# Altium schematic sheet FPGA_A3P10002.SchDoc
size A2
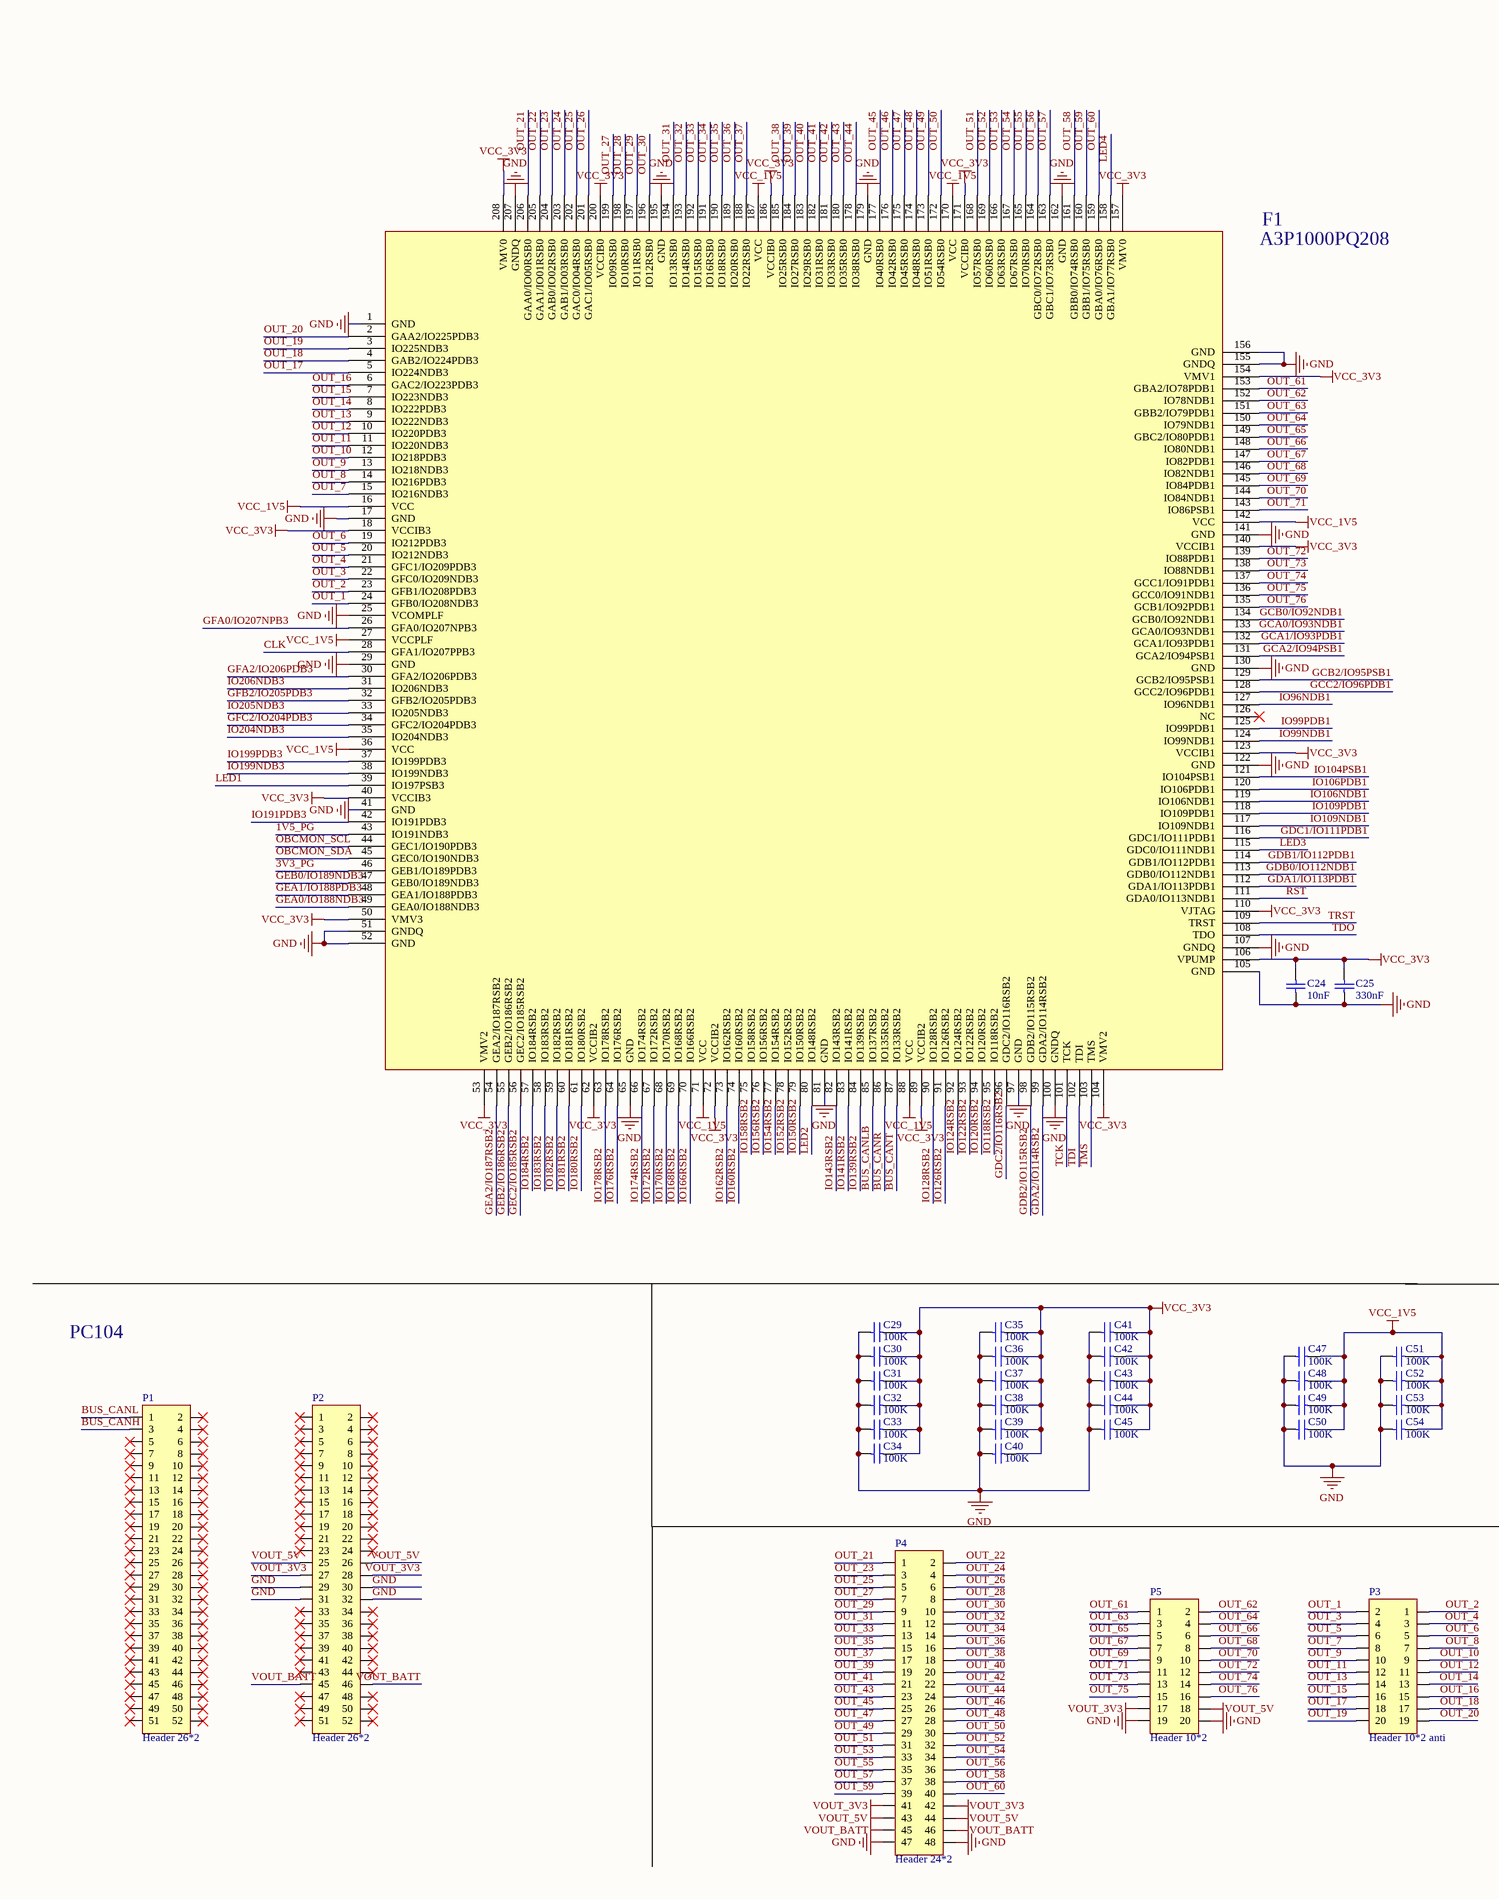
[diagram p0: FPGA_A3P10002.SchDoc, left]
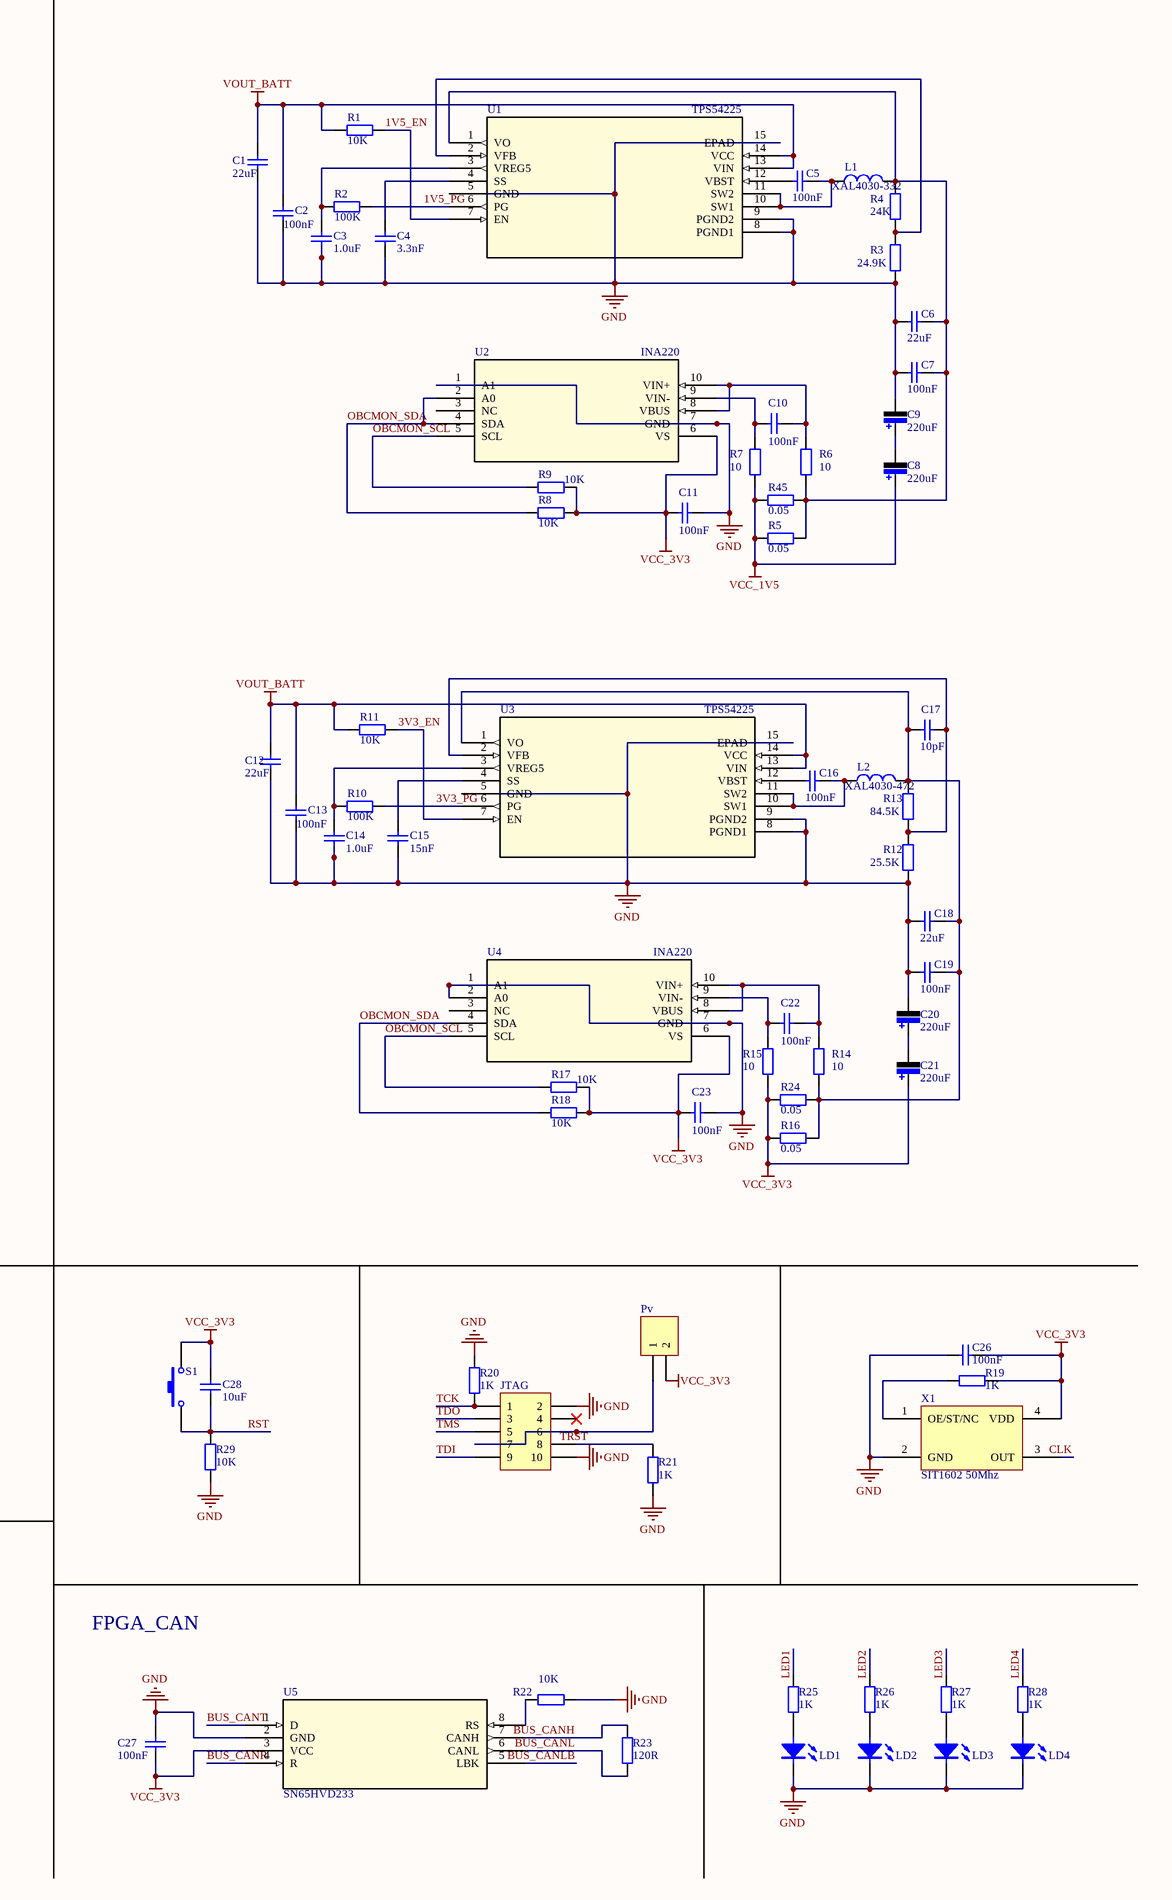
[diagram p1: FPGA_A3P10002.SchDoc, right]

## Parts
C1  value 22uF  [C 1210]  (hidden comment: Cap)
C2  value 100nF  [0603-2]  (hidden comment: Cap)
C3  value 1.0uF  [0603-2]  (hidden comment: Cap)
C4  value 3.3nF  [0603-2]  (hidden comment: Cap)
C5  value 100nF  [0603-2]  (hidden comment: Cap)
C6  value 22uF  [C 1210]  (hidden comment: Cap)
C7  value 100nF  [0603-2]  (hidden comment: Cap)
C8  value 220uF  [CAP-7343]  (hidden comment: Cap Pol)
C9  value 220uF  [CAP-7343]  (hidden comment: Cap Pol)
C10  value 100nF  [0603-2]  (hidden comment: Cap)
C11  value 100nF  [0603-2]  (hidden comment: Cap)
C12  value 22uF  [C 1210]  (hidden comment: Cap)
C13  value 100nF  [0603-2]  (hidden comment: Cap)
C14  value 1.0uF  [0603-2]  (hidden comment: Cap)
C15  value 15nF  [0603-2]  (hidden comment: Cap)
C16  value 100nF  [0603-2]  (hidden comment: Cap)
C17  value 10pF  [0603-2]  (hidden comment: Cap)
C18  value 22uF  [C 1210]  (hidden comment: Cap)
C19  value 100nF  [0603-2]  (hidden comment: Cap)
C20  value 220uF  [CAP-7343]  (hidden comment: Cap Pol)
C21  value 220uF  [CAP-7343]  (hidden comment: Cap Pol)
C22  value 100nF  [0603-2]  (hidden comment: Cap)
C23  value 100nF  [0603-2]  (hidden comment: Cap)
C24  value 10nF  [0603-2]  (hidden comment: Cap)
C25  value 330nF  [0603-2]  (hidden comment: Cap)
C26  value 100nF  [0603-2]  (hidden comment: Cap)
C27  value 100nF  [0603-2]  (hidden comment: Cap)
C28  value 10uF  [0603-2]  (hidden comment: Cap)
C29  value 100K  [C 0402]  (hidden comment: Cap)
C30  value 100K  [C 0402]  (hidden comment: Cap)
C31  value 100K  [C 0402]  (hidden comment: Cap)
C32  value 100K  [C 0402]  (hidden comment: Cap)
C33  value 100K  [C 0402]  (hidden comment: Cap)
C34  value 100K  [C 0402]  (hidden comment: Cap)
C35  value 100K  [C 0402]  (hidden comment: Cap)
C36  value 100K  [C 0402]  (hidden comment: Cap)
C37  value 100K  [C 0402]  (hidden comment: Cap)
C38  value 100K  [C 0402]  (hidden comment: Cap)
C39  value 100K  [C 0402]  (hidden comment: Cap)
C40  value 100K  [C 0402]  (hidden comment: Cap)
C41  value 100K  [C 0402]  (hidden comment: Cap)
C42  value 100K  [C 0402]  (hidden comment: Cap)
C43  value 100K  [C 0402]  (hidden comment: Cap)
C44  value 100K  [C 0402]  (hidden comment: Cap)
C45  value 100K  [C 0402]  (hidden comment: Cap)
C47  value 100K  [C 0402]  (hidden comment: Cap)
C48  value 100K  [C 0402]  (hidden comment: Cap)
C49  value 100K  [C 0402]  (hidden comment: Cap)
C50  value 100K  [C 0402]  (hidden comment: Cap)
C51  value 100K  [C 0402]  (hidden comment: Cap)
C52  value 100K  [C 0402]  (hidden comment: Cap)
C53  value 100K  [C 0402]  (hidden comment: Cap)
C54  value 100K  [C 0402]  (hidden comment: Cap)
F1  A3P1000PQ208  [SQFP50P3060X3060X410-208N]
JTAG  (no value)  [HDR2X5]
L1  XAL4030-332  [XAL40xx]
L2  XAL4030-472  [XAL40xx]
LD1  (no value)  [LED-0603]
LD2  (no value)  [LED-0603]
LD3  (no value)  [LED-0603]
LD4  (no value)  [LED-0603]
P1  Header 26*2  [Header 26*2-2.54mm]
P2  Header 26*2  [Header 26*2-2.54mm]
P3  Header 10*2 anti  [header 10*2-2.54MM]
P4  Header 24*2  [Header 24*2-2.54mm]
P5  Header 10*2  [header 10*2-2.54MM]
Pv  (no value)  [HDR1X2]
R1  value 10K  [0603-1]  (hidden comment: Res1)
R2  value 100K  [0603-1]  (hidden comment: Res1)
R3  value 24.9K  [0603-1]  (hidden comment: Res1)
R4  value 24K  [0603-1]  (hidden comment: Res1)
R5  value 0.05  [1206]  (hidden comment: Res1)
R6  value 10  [0603-1]  (hidden comment: Res1)
R7  value 10  [0603-1]  (hidden comment: Res1)
R8  value 10K  [0603-1]  (hidden comment: Res1)
R9  value 10K  [0603-1]  (hidden comment: Res1)
R10  value 100K  [0603-1]  (hidden comment: Res1)
R11  value 10K  [0603-1]  (hidden comment: Res1)
R12  value 25.5K  [0603-1]  (hidden comment: Res1)
R13  value 84.5K  [0603-1]  (hidden comment: Res1)
R14  value 10  [0603-1]  (hidden comment: Res1)
R15  value 10  [0603-1]  (hidden comment: Res1)
R16  value 0.05  [1206]  (hidden comment: Res1)
R17  value 10K  [0603-1]  (hidden comment: Res1)
R18  value 10K  [0603-1]  (hidden comment: Res1)
R19  value 1K  [0603-1]  (hidden comment: Res1)
R20  value 1K  [0603-1]  (hidden comment: Res1)
R21  value 1K  [0603-1]  (hidden comment: Res1)
R22  value 10K  [0603-1]  (hidden comment: Res1)
R23  value 120R  [0603-1]  (hidden comment: Res1)
R24  value 0.05  [1206]  (hidden comment: Res1)
R25  value 1K  [0603-1]  (hidden comment: Res1)
R26  value 1K  [0603-1]  (hidden comment: Res1)
R27  value 1K  [0603-1]  (hidden comment: Res1)
R28  value 1K  [0603-1]  (hidden comment: Res1)
R29  value 10K  [0603-1]  (hidden comment: Res1)
R45  value 0.05  [1206]  (hidden comment: Res1)
S1  (no value)  [SW_PB2_A1]
U1  TPS54225  [TPS54225]
U2  INA220  [INA220]
U3  TPS54225  [TPS54225]
U4  INA220  [INA220]
U5  SN65HVD233  [SN65HVD233]
X1  SIT1602 50Mhz  [SIT1602-2.5*2mm]

## Nets
GND: C1.1 C2.1 C3.1 C4.1 C6.2 C7.2 C9.2 C11.1 C12.1 C13.1 C14.1 C15.1 C18.2 C19.2 C20.2 C23.1 C24.1 C25.1 C26.1 C27.2 C29.1 C30.1 C31.1 C32.1 C33.1 C34.1 C35.1 C36.1 C37.1 C38.1 C39.1 C40.1 C41.1 C42.1 C43.1 C44.1 C45.1 C47.1 C48.1 C49.1 C50.1 C51.1 C52.1 C53.1 C54.1 F1.1(GND) F1.17(GND) F1.25(VCOMPLF) F1.29(GND) F1.41(GND) F1.51(GNDQ) F1.52(GND) F1.65(GND) F1.81(GND) F1.97(GND) F1.100(GNDQ) F1.105(GND) F1.107(GNDQ) F1.122(GND) F1.130(GND) F1.141(GND) F1.155(GNDQ) F1.156(GND) F1.162(GND) F1.179(GND) F1.195(GND) F1.207(GNDQ) JTAG.2 JTAG.10 LD1.2(C) LD2.2(C) LD3.2(C) LD4.2(C) P2.29 P2.30 P2.31 P2.32 P4.47 P4.48 P5.19 P5.20 R3.1 R12.1 R20.2 R21.1 R22.2 R29.1 U1.8(PGND1) U1.9(PGND2) U1.15(EPAD) U2.1(A1) U2.7(GND) U3.8(PGND1) U3.9(PGND2) U3.15(EPAD) U4.1(A1) U4.2(A0) U4.7(GND) U5.2(GND) X1.2(GND)
VCC_1V5: C8.1 C47.2 C48.2 C49.2 C50.2 C51.2 C52.2 C53.2 C54.2 F1.16(VCC) F1.27(VCCPLF) F1.36(VCC) F1.71(VCC) F1.88(VCC) F1.142(VCC) F1.170(VCC) F1.187(VCC) R5.2 R7.1 R45.2
VCC_3V3: C11.2 C21.1 C23.2 C24.2 C25.2 C26.2 C27.1 C28.2 C29.2 C30.2 C31.2 C32.2 C33.2 C34.2 C35.2 C36.2 C37.2 C38.2 C39.2 C40.2 C41.2 C42.2 C43.2 C44.2 C45.2 F1.18(VCCIB3) F1.40(VCCIB3) F1.50(VMV3) F1.53(VMV2) F1.62(VCCIB2) F1.72(VCCIB2) F1.89(VCCIB2) F1.104(VMV2) F1.106(VPUMP) F1.110(VJTAG) F1.123(VCCIB1) F1.140(VCCIB1) F1.154(VMV1) F1.157(VMV0) F1.171(VCCIB0) F1.186(VCCIB0) F1.200(VCCIB0) F1.208(VMV0) Pv.2 R8.1 R9.1 R15.1 R16.2 R17.1 R18.1 R19.2 R24.2 S1.2 U2.6(VS) U4.6(VS) U5.3(VCC) X1.4(VDD)
VOUT_3V3: P2.27 P2.28 P4.41 P4.42 P5.17
VOUT_5V: P2.25 P2.26 P4.43 P4.44 P5.18
VOUT_BATT: C1.2 C2.2 C12.2 C13.2 P2.45 P2.46 P4.45 P4.46 R1.1 R11.1 U1.13(VIN) U1.14(VCC) U3.13(VIN) U3.14(VCC)
1V5_EN: R1.2 U1.7(EN)
1V5_PG: F1.43(IO191NDB3) R2.2 U1.6(PG)
3V3_EN: R11.2 U3.7(EN)
3V3_PG: F1.46(GEB1/IO189PDB3) R10.2 U3.6(PG)
BUS_CANH: P1.3 R23.2 U5.7(CANH)
BUS_CANL: P1.1 R23.1 U5.6(CANL)
BUS_CANLB: F1.85(IO137RSB2) U5.5(LBK)
BUS_CANR: F1.86(IO135RSB2) U5.4(R)
BUS_CANT: F1.87(IO133RSB2) U5.1(D)
CLK: F1.28(GFA1/IO207PPB3) X1.3(OUT)
GCA0/IO93NDB1: F1.133(GCA0/IO93NDB1)
GCA1/IO93PDB1: F1.132(GCA1/IO93PDB1)
GCA2/IO94PSB1: F1.131(GCA2/IO94PSB1)
GCB0/IO92NDB1: F1.134(GCB0/IO92NDB1)
GCB2/IO95PSB1: F1.129(GCB2/IO95PSB1)
GCC2/IO96PDB1: F1.128(GCC2/IO96PDB1)
GDA1/IO113PDB1: F1.112(GDA1/IO113PDB1)
GDA2/IO114RSB2: F1.99(GDA2/IO114RSB2)
GDB0/IO112NDB1: F1.113(GDB0/IO112NDB1)
GDB1/IO112PDB1: F1.114(GDB1/IO112PDB1)
GDB2/IO115RSB2: F1.98(GDB2/IO115RSB2)
GDC1/IO111PDB1: F1.116(GDC1/IO111PDB1)
GDC2/IO116RSB2: F1.96(GDC2/IO116RSB2)
GEA0/IO188NDB3: F1.49(GEA0/IO188NDB3)
GEA1/IO188PDB3: F1.48(GEA1/IO188PDB3)
GEA2/IO187RSB2: F1.54(GEA2/IO187RSB2)
GEB0/IO189NDB3: F1.47(GEB0/IO189NDB3)
GEB2/IO186RSB2: F1.55(GEB2/IO186RSB2)
GEC2/IO185RSB2: F1.56(GEC2/IO185RSB2)
GFA0/IO207NPB3: F1.26(GFA0/IO207NPB3)
GFA2/IO206PDB3: F1.30(GFA2/IO206PDB3)
GFB2/IO205PDB3: F1.32(GFB2/IO205PDB3)
GFC2/IO204PDB3: F1.34(GFC2/IO204PDB3)
IO96NDB1: F1.127(IO96NDB1)
IO99NDB1: F1.124(IO99NDB1)
IO99PDB1: F1.125(IO99PDB1)
IO104PSB1: F1.121(IO104PSB1)
IO106NDB1: F1.119(IO106NDB1)
IO106PDB1: F1.120(IO106PDB1)
IO109NDB1: F1.117(IO109NDB1)
IO109PDB1: F1.118(IO109PDB1)
IO118RSB2: F1.95(IO118RSB2)
IO120RSB2: F1.94(IO120RSB2)
IO122RSB2: F1.93(IO122RSB2)
IO124RSB2: F1.92(IO124RSB2)
IO126RSB2: F1.91(IO126RSB2)
IO128RSB2: F1.90(IO128RSB2)
IO139RSB2: F1.84(IO139RSB2)
IO141RSB2: F1.83(IO141RSB2)
IO143RSB2: F1.82(IO143RSB2)
IO150RSB2: F1.79(IO150RSB2)
IO152RSB2: F1.78(IO152RSB2)
IO154RSB2: F1.77(IO154RSB2)
IO156RSB2: F1.76(IO156RSB2)
IO158RSB2: F1.75(IO158RSB2)
IO160RSB2: F1.74(IO160RSB2)
IO162RSB2: F1.73(IO162RSB2)
IO166RSB2: F1.70(IO166RSB2)
IO168RSB2: F1.69(IO168RSB2)
IO170RSB2: F1.68(IO170RSB2)
IO172RSB2: F1.67(IO172RSB2)
IO174RSB2: F1.66(IO174RSB2)
IO176RSB2: F1.64(IO176RSB2)
IO178RSB2: F1.63(IO178RSB2)
IO180RSB2: F1.61(IO180RSB2)
IO181RSB2: F1.60(IO181RSB2)
IO182RSB2: F1.59(IO182RSB2)
IO183RSB2: F1.58(IO183RSB2)
IO184RSB2: F1.57(IO184RSB2)
IO191PDB3: F1.42(IO191PDB3)
IO199NDB3: F1.38(IO199NDB3)
IO199PDB3: F1.37(IO199PDB3)
IO204NDB3: F1.35(IO204NDB3)
IO205NDB3: F1.33(IO205NDB3)
IO206NDB3: F1.31(IO206NDB3)
LED1: F1.39(IO197PSB3) R25.2
LED2: F1.80(IO148RSB2) R26.2
LED3: F1.115(GDC0/IO111NDB1) R27.2
LED4: F1.158(GBA1/IO77RSB0) R28.2
OBCMON_SCL: F1.44(GEC1/IO190PDB3) R9.2 R17.2 U2.5(SCL) U4.5(SCL)
OBCMON_SDA: F1.45(GEC0/IO190NDB3) R8.2 R18.2 U2.2(A0) U2.4(SDA) U4.4(SDA)
OUT_1: F1.24(GFB0/IO208NDB3) P3.2
OUT_2: F1.23(GFB1/IO208PDB3) P3.1
OUT_3: F1.22(GFC0/IO209NDB3) P3.4
OUT_4: F1.21(GFC1/IO209PDB3) P3.3
OUT_5: F1.20(IO212NDB3) P3.6
OUT_6: F1.19(IO212PDB3) P3.5
OUT_7: F1.15(IO216NDB3) P3.8
OUT_8: F1.14(IO216PDB3) P3.7
OUT_9: F1.13(IO218NDB3) P3.10
OUT_10: F1.12(IO218PDB3) P3.9
OUT_11: F1.11(IO220NDB3) P3.12
OUT_12: F1.10(IO220PDB3) P3.11
OUT_13: F1.9(IO222NDB3) P3.14
OUT_14: F1.8(IO222PDB3) P3.13
OUT_15: F1.7(IO223NDB3) P3.16
OUT_16: F1.6(GAC2/IO223PDB3) P3.15
OUT_17: F1.5(IO224NDB3) P3.18
OUT_18: F1.4(GAB2/IO224PDB3) P3.17
OUT_19: F1.3(IO225NDB3) P3.20
OUT_20: F1.2(GAA2/IO225PDB3) P3.19
OUT_21: F1.206(GAA0/IO00RSB0) P4.1
OUT_22: F1.205(GAA1/IO01RSB0) P4.2
OUT_23: F1.204(GAB0/IO02RSB0) P4.3
OUT_24: F1.203(GAB1/IO03RSB0) P4.4
OUT_25: F1.202(GAC0/IO04RSB0) P4.5
OUT_26: F1.201(GAC1/IO05RSB0) P4.6
OUT_27: F1.199(IO09RSB0) P4.7
OUT_28: F1.198(IO10RSB0) P4.8
OUT_29: F1.197(IO11RSB0) P4.9
OUT_30: F1.196(IO12RSB0) P4.10
OUT_31: F1.194(IO13RSB0) P4.11
OUT_32: F1.193(IO14RSB0) P4.12
OUT_33: F1.192(IO15RSB0) P4.13
OUT_34: F1.191(IO16RSB0) P4.14
OUT_35: F1.190(IO18RSB0) P4.15
OUT_36: F1.189(IO20RSB0) P4.16
OUT_37: F1.188(IO22RSB0) P4.17
OUT_38: F1.185(IO25RSB0) P4.18
OUT_39: F1.184(IO27RSB0) P4.19
OUT_40: F1.183(IO29RSB0) P4.20
OUT_41: F1.182(IO31RSB0) P4.21
OUT_42: F1.181(IO33RSB0) P4.22
OUT_43: F1.180(IO35RSB0) P4.23
OUT_44: F1.178(IO38RSB0) P4.24
OUT_45: F1.177(IO40RSB0) P4.25
OUT_46: F1.176(IO42RSB0) P4.26
OUT_47: F1.175(IO45RSB0) P4.27
OUT_48: F1.174(IO48RSB0) P4.28
OUT_49: F1.173(IO51RSB0) P4.29
OUT_50: F1.172(IO54RSB0) P4.30
OUT_51: F1.168(IO57RSB0) P4.31
OUT_52: F1.169(IO60RSB0) P4.32
OUT_53: F1.166(IO63RSB0) P4.33
OUT_54: F1.167(IO67RSB0) P4.34
OUT_55: F1.165(IO70RSB0) P4.35
OUT_56: F1.164(GBC0/IO72RSB0) P4.36
OUT_57: F1.163(GBC1/IO73RSB0) P4.37
OUT_58: F1.161(GBB0/IO74RSB0) P4.38
OUT_59: F1.160(GBB1/IO75RSB0) P4.39
OUT_60: F1.159(GBA0/IO76RSB0) P4.40
OUT_61: F1.153(GBA2/IO78PDB1) P5.1
OUT_62: F1.152(IO78NDB1) P5.2
OUT_63: F1.151(GBB2/IO79PDB1) P5.3
OUT_64: F1.150(IO79NDB1) P5.4
OUT_65: F1.149(GBC2/IO80PDB1) P5.5
OUT_66: F1.148(IO80NDB1) P5.6
OUT_67: F1.147(IO82PDB1) P5.7
OUT_68: F1.146(IO82NDB1) P5.8
OUT_69: F1.145(IO84PDB1) P5.9
OUT_70: F1.144(IO84NDB1) P5.10
OUT_71: F1.143(IO86PSB1) P5.11
OUT_72: F1.139(IO88PDB1) P5.12
OUT_73: F1.138(IO88NDB1) P5.13
OUT_74: F1.137(GCC1/IO91PDB1) P5.14
OUT_75: F1.136(GCC0/IO91NDB1) P5.15
OUT_76: F1.135(GCB1/IO92PDB1) P5.16
RST: C28.1 F1.111(GDA0/IO113NDB1) R29.2 S1.1
TCK: F1.101(TCK) JTAG.1 R20.1
TDI: F1.102(TDI) JTAG.9
TDO: F1.108(TDO) JTAG.3
TMS: F1.103(TMS) JTAG.5
TRST: F1.109(TRST) JTAG.8 R21.2
NetC3_2: C3.2 R2.1 U1.3(VREG5)
NetC4_2: C4.2 U1.4(SS)
NetC5_1: C5.1 L1.1 U1.10(SW1) U1.11(SW2)
NetC5_2: C5.2 U1.12(VBST)
NetC6_1: C6.1 C7.1 L1.2 R4.2 R5.1 R6.1 R45.1 U1.1(VO)
NetC8_2: C8.2 C9.1
NetC10_1: C10.1 R6.2 U2.8(VBUS) U2.10(VIN+)
NetC10_2: C10.2 R7.2 U2.9(VIN-)
NetC14_2: C14.2 R10.1 U3.3(VREG5)
NetC15_2: C15.2 U3.4(SS)
NetC16_1: C16.1 L2.1 U3.10(SW1) U3.11(SW2)
NetC16_2: C16.2 U3.12(VBST)
NetC17_1: C17.1 R12.2 R13.1 U3.2(VFB)
NetC17_2: C17.2 C18.1 C19.1 L2.2 R13.2 R14.1 R16.1 R24.1 U3.1(VO)
NetC20_1: C20.1 C21.2
NetC22_1: C22.1 R14.2 U4.8(VBUS) U4.10(VIN+)
NetC22_2: C22.2 R15.2 U4.9(VIN-)
NetJTAG_6: JTAG.6 JTAG.7 Pv.1
NetLD1_1: LD1.1(A) R25.1
NetLD2_1: LD2.1(A) R26.1
NetLD3_1: LD3.1(A) R27.1
NetLD4_1: LD4.1(A) R28.1
NetR3_2: R3.2 R4.1 U1.2(VFB)
NetR19_1: R19.1 X1.1(OE/ST/NC)
NetR22_1: R22.1 U5.8(RS)

Not connected (* = marked no-connect by the designer): F1 126(NC)*; JTAG 4*; P1 2* 4* 5* 6* 7* 8* 9* 10* 11* 12* 13* 14* 15* 16* 17* 18* 19* 20* 21* 22* 23* 24* 25* 26* 27* 28* 29* 30* 31* 32* 33* 34* 35* 36* 37* 38* 39* 40* 41* 42* 43* 44* 45* 46* 47* 48* 49* 50* 51* 52*; P2 1* 2* 3* 4* 5* 6* 7* 8* 9* 10* 11* 12* 13* 14* 15* 16* 17* 18* 19* 20* 21* 22* 23* 24* 33* 34* 35* 36* 37* 38* 39* 40* 41* 42* 43* 44* 47* 48* 49* 50* 51* 52*; U1 5(GND); U2 3(NC); U3 5(GND); U4 3(NC)

## Notes on the sheet
- PC104
- FPGA_CAN

## Library data of the parts
C1-C7 C10-C19 C22-C45 C47-C54 = Cap: 无极性电容; Published: 8-Jun-2000; LatestRevisionDate: 17-Jul-2002; LatestRevisionNote: Re-released for DXP Platform.; PackageReference: RAD-0.3; Publisher: Altium Limited
C8 C9 C20 C21 = Cap Pol: 极性电解电容; Published: 8-Jun-2000; LatestRevisionDate: 17-Jul-2002; LatestRevisionNote: Re-released for DXP Platform.; PackageReference: RB7.6-15; Publisher: Altium Limited
F1 = Component_1
JTAG = Header 5X2: Header, 5-Pin, Dual row; LatestRevisionDate: 17-Jul-2002; LatestRevisionNote: Re-released for DXP Platform.; Publisher: Altium Limited
L1 L2 = XAL40xx
LD1-LD4 = LED
Pv = Header 2: Header, 2-Pin; LatestRevisionDate: 17-Jul-2002; LatestRevisionNote: Re-released for DXP Platform.; Publisher: Altium Limited
R1-R29 R45 = Res1: 贴片电阻; Published: 8-Jun-2000; LatestRevisionDate: 17-Jul-2002; LatestRevisionNote: Re-released for DXP Platform.; PackageReference: AXIAL-0.4; Publisher: Altium Limited
S1 = SW-PB: 微动开关; Published: 24-Mar-1999; LatestRevisionDate: 17-Jul-2002; LatestRevisionNote: Re-released for DXP Platform.; PackageReference: SPST-2; Publisher: Altium Limited
U1 U3 = TPS54225_PWP_14: Imported; Vendor: Texas Instruments; PACKAGE_DESIGNATOR: PWP; PIN_COUNT: 14; FAMILY_NAME: STEP-DOWN REGULATOR; INDUSTRY_STD_PKG_TYPE: HTSSOP; Manufacturer_Part_Number: tps54225_pwp_14; GENERIC_PART_NUMBER: TPS54225; Manufacturer: Texas Instruments; Datasheet_URL: http://www.ti.com/lit/gpn/TPS54225; Value: Value; Type: Type; RefDes: RefDes
U2 U4 = INA220_DGS_10: Imported; Manufacturer: Texas Instruments; INDUSTRY_STD_PKG_TYPE: MSOP; FAMILY_NAME: CURRENT SHUNT MONITOR; PIN_COUNT: 10; PACKAGE_DESIGNATOR: DGS; Datasheet_URL: http://www.ti.com/lit/gpn/INA220; GENERIC_PART_NUMBER: INA220; Vendor: Texas Instruments; Manufacturer_Part_Number: ina220_dgs_10; Value: Value; Type: Type; RefDes: RefDes
U5 = SN65HVD233_D_8: Imported; Manufacturer: Texas Instruments; INDUSTRY_STD_PKG_TYPE: SOIC; FAMILY_NAME: CAN; PIN_COUNT: 8; PACKAGE_DESIGNATOR: D; Datasheet_URL: http://www.ti.com/lit/gpn/SN65HVD233; GENERIC_PART_NUMBER: SN65HVD233; Vendor: Texas Instruments; Manufacturer_Part_Number: sn65hvd233_d_8; Value: Value; Type: Type; RefDes: RefDes
X1 = SIT1602: 2.5*2.0mm